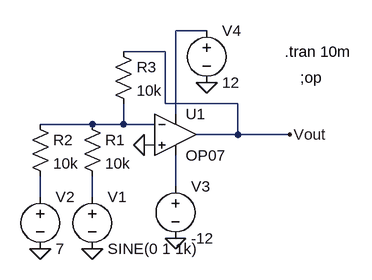
[diagram p0: schematic Adder.asc]
Adder.asc, the LTspice schematic file:
Version 4
SHEET 1 880 680
WIRE 256 32 208 32
WIRE 192 64 128 64
WIRE 192 144 192 64
WIRE 304 144 192 144
WIRE 208 160 208 32
WIRE 80 176 0 176
WIRE 128 176 128 144
WIRE 128 176 80 176
WIRE 176 176 128 176
WIRE 304 192 304 144
WIRE 304 192 240 192
WIRE 384 192 304 192
WIRE 176 208 160 208
WIRE 208 272 208 224
WIRE 0 288 0 256
WIRE 80 288 80 256
FLAG 160 208 0
FLAG 80 368 0
FLAG 0 368 0
FLAG 384 192 Vout
FLAG 256 112 0
FLAG 208 352 0
SYMBOL OpAmps\\OP07 208 128 R0
SYMATTR InstName U1
SYMBOL res 64 160 R0
SYMATTR InstName R1
SYMATTR Value 10k
SYMBOL res -16 160 R0
SYMATTR InstName R2
SYMATTR Value 10k
SYMBOL voltage 80 272 R0
WINDOW 123 0 0 Left 0
WINDOW 39 0 0 Left 0
SYMATTR InstName V1
SYMATTR Value SINE(0 1 1k)
SYMBOL voltage 0 272 R0
WINDOW 123 0 0 Left 0
WINDOW 39 0 0 Left 0
SYMATTR InstName V2
SYMATTR Value 7
SYMBOL voltage 208 256 R0
WINDOW 123 0 0 Left 0
WINDOW 39 0 0 Left 0
SYMATTR InstName V3
SYMATTR Value -12
SYMBOL voltage 256 16 R0
WINDOW 123 0 0 Left 0
WINDOW 39 0 0 Left 0
SYMATTR InstName V4
SYMATTR Value 12
SYMBOL res 112 48 R0
SYMATTR InstName R3
SYMATTR Value 10k
TEXT 400 104 Left 2 !;op
TEXT 376 64 Left 2 !.tran 10m

The netlist it stands for:
* Adder.asc
XU1 0 N002 N001 N003 Vout LT1001  ; OP07, pins In+ In- V+ V- OUT
R1 N002 N005 10k
R2 N002 N004 10k
V1 N005 0 SINE(0 1 1k)
V2 N004 0 7
V3 N003 0 -12
V4 N001 0 12
R3 Vout N002 10k
;op
.tran 10m
.lib LTC.lib
.backanno
.end